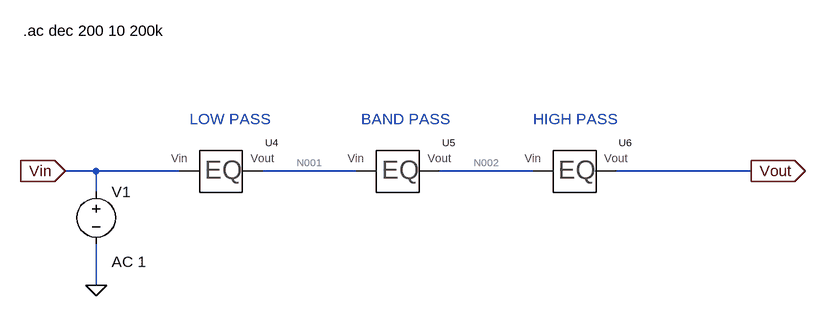
[diagram p0: schematic FinalDraft.asc]
FinalDraft.asc, the LTspice schematic file:
Version 4.1
SHEET 1 880 680
WIRE -352 80 -400 80
WIRE -224 80 -352 80
WIRE 48 80 -96 80
WIRE 320 80 176 80
WIRE 656 80 448 80
WIRE -352 112 -352 80
WIRE -352 256 -352 192
FLAG -400 80 Vin
IOPIN -400 80 In
FLAG -352 256 0
FLAG 656 80 Vout
IOPIN 656 80 Out
SYMBOL voltage -352 96 R0
WINDOW 123 24 124 Left 2
WINDOW 39 0 0 Left 0
SYMATTR Value2 AC 1
SYMATTR InstName V1
SYMATTR Value ""
SYMBOL Equaliser\\Equaliser -160 80 R0
SYMATTR InstName U4
SYMATTR SpiceLine C1=0.056uF C2=3.3uF R1=68k R2=510
SYMATTR SpiceLine2 BOOST=1m CUT=20k
SYMBOL Equaliser\\Equaliser 112 80 R0
SYMATTR InstName U5
SYMATTR SpiceLine C1=3900pF C2=0.22uF R1=68k R2=470
SYMATTR SpiceLine2 BOOST=20k CUT=1m
SYMBOL Equaliser\\Equaliser 384 80 R0
SYMATTR InstName U6
SYMATTR SpiceLine C1=330pF C2=0.012uF R1=51k R2=510
SYMATTR SpiceLine2 BOOST=1m CUT=20k
TEXT -464 -136 Left 2 !.ac dec 200 10 200k
TEXT -208 0 Left 2 ;LOW PASS
TEXT 56 0 Left 2 ;BAND PASS
TEXT 320 0 Left 2 ;HIGH PASS

The netlist it stands for:
* FinalDraft.asc
V1 Vin 0 AC 1
X§U4 Vin N001 Equaliser Equaliser C1=0.056uF C2=3.3uF R1=68k R2=510 BOOST=1m CUT=20k  ; pins Vin Vout
X§U5 N001 N002 Equaliser Equaliser C1=3900pF C2=0.22uF R1=68k R2=470 BOOST=20k CUT=1m  ; pins Vin Vout
X§U6 N002 Vout Equaliser Equaliser C1=330pF C2=0.012uF R1=51k R2=510 BOOST=1m CUT=20k  ; pins Vin Vout
.ac dec 200 10 200k
* LOW PASS
* BAND PASS
* HIGH PASS
.lib Equaliser.sub
.backanno
.end

* Results of the author's LTspice run, read from the files saved beside the schematic
* Operating Point, zero values left out:
*   V(n001) = 260 µV
*   V(n002) = 520 µV
*   V(vout) = 780 µV
*   I(V1) = 10 nA
*   Ix(u4:vin) = -10 nA
*   Ix(u4:vout) = 10 nA
*   Ix(u5:vin) = -10 nA
*   Ix(u5:vout) = 10 nA
*   Ix(u6:vin) = -9.999 nA
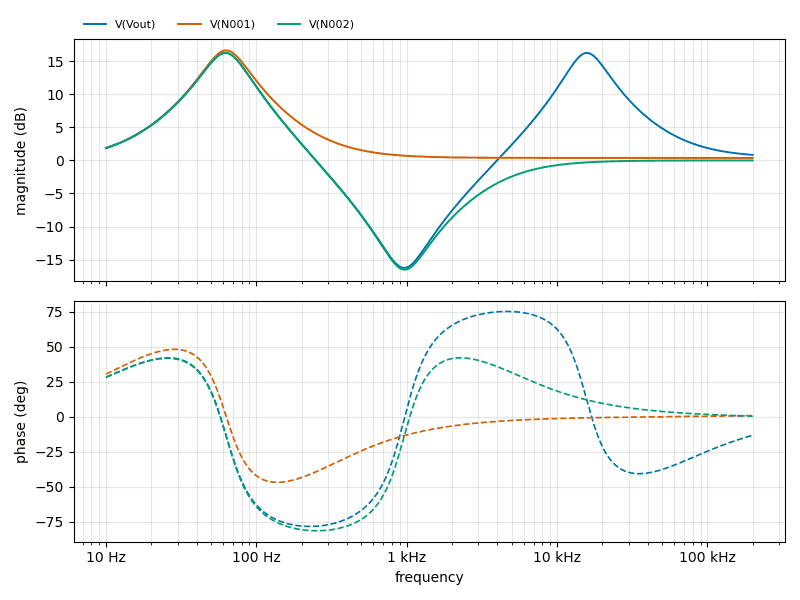
[diagram p1: AC Analysis of FinalDraft.asc, plotted from the saved traces]
* AC Analysis, 1 run:
*   V(Vout): 1.86 dB at 10 Hz, 0.83 dB at 200 kHz, peak 16.26 dB at 62.37 Hz, 3 dB below the peak at 44.2 Hz and 86.27 Hz
*   V(N001): 1.87 dB at 10 Hz, 0.38 dB at 200 kHz, peak 16.63 dB at 63.1 Hz, 3 dB below the peak at 44.82 Hz and 88.37 Hz
*   V(N002): 1.86 dB at 10 Hz, 0.00 dB at 200 kHz, peak 16.26 dB at 62.37 Hz, 3 dB below the peak at 44.2 Hz and 86.26 Hz